# EAGLE design basic board (EAGLE 9.1.3)
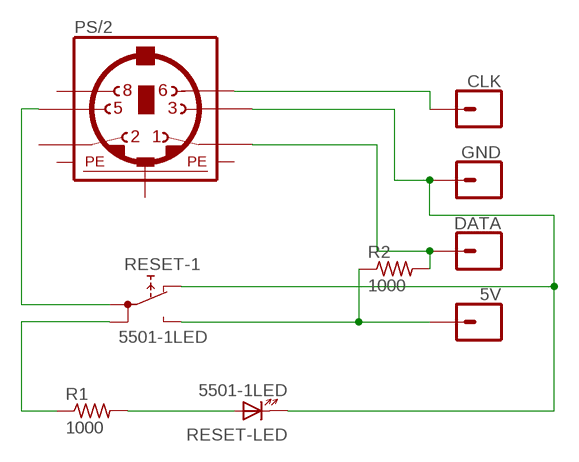
[diagram p0: schematic, sheet 1]

## Parts
5V  CONN_01  [1X01]
CLK  CONN_01  [1X01]
DATA  CONN_01  [1X01]
GND  CONN_01  [1X01]
PS/2  MINI_DIN_6  [M_DIN6]
R1  1000  R-US_0309/12  [0309/12]
R2  1000  R-US_0309/12  [0309/12]
RESET  5501-1LED  [5501-1LED]

## Nets
GND: GND.1 PS/2.3 RESET.-(-LED:K) RESET.NC(-1:NC)
N$1: CLK.1 PS/2.6
N$3: DATA.1 PS/2.1 R2.2
N$4: PS/2.5 RESET.1A(-1:1A)
N$5: 5V.1 R2.1 RESET.NO(-1:NO)
N$6: R1.1 RESET.1B(-1:1B)
N$7: R1.2 RESET.+(-LED:A)
Unconnected: PS/2.2 PS/2.8

## Power pins joined to a net without a drawn wire
PE1: PS/2.SH1(PE1)
PE2: PS/2.SH2(PE2)
PE3: PS/2.SH3(PE3)

## Library data of the parts
5V CLK DATA GND = SparkFun-Connectors:CONN_01: Single connection point. Often used as Generic Header-pin footprint for 0.1 inch spaced/style header connections On any of the 0.1 inch spaced packages, you can populate with these: Break Away Headers - Straight <https://www.sparkfun.com/products/116> (PRT-00116) Break Away Male Headers - Right Angle <https://www.sparkfun.com/products/553> (PRT-00553) Female Headers <https://www.sparkfun.com/products/115> (PRT-00115) Break Away Headers - Machine Pin <https://www.sparkfun.com/products/117> (PRT-00117) Break Away Female Headers - Swiss Machine Pin <https://www.sparkfun.com/products/743> (PRT-00743) This device is also useful as a general connection point to wire up your design to another part of your project. Our various solder wires solder well into these plated through hole pads. Hook-Up Wire - Assortment (Stranded, 22 AWG) <https://www.sparkfun.com/products/11375> (PRT-11375) Hook-Up Wire - Assortment (Solid Core, 22 AWG) <https://www.sparkfun.com/products/11367> (PRT-11367) View the entire wire category on our website here <https://www.sparkfun.com/categories/141> Special notes: SMTSO-256-ET is a "flush mount" nut for a 4-40 screw. We mostly use this on specialty testbeds; it is a nice way to connect hardware to your PCB at an adjustable hieght. Also note, the SNAP packages are for using a snappable style connector. We sell a baggie of snaps and they are also used on two LilyPad designs: Snap Assortment - 30 pack (male and female) <https://www.sparkfun.com/products/11347> (DEV-11347) LilyPad Arduino SimpleSnap <https://www.sparkfun.com/products/10941> (DEV-10941) LilyPad SimpleSnap Protoboard <https://www.sparkfun.com/products/10940> (DEV-10940)
PS/2 = mini_din:MINI_DIN_6
R1 R2 = resistor:R-US_: RESISTOR, American symbol
RESET = switch:55?-1LED: PUSHBUTTON SERIES 5500 SWITCHES 1 LED Source: www.e-switch.com .. 5500.pdf

## Board
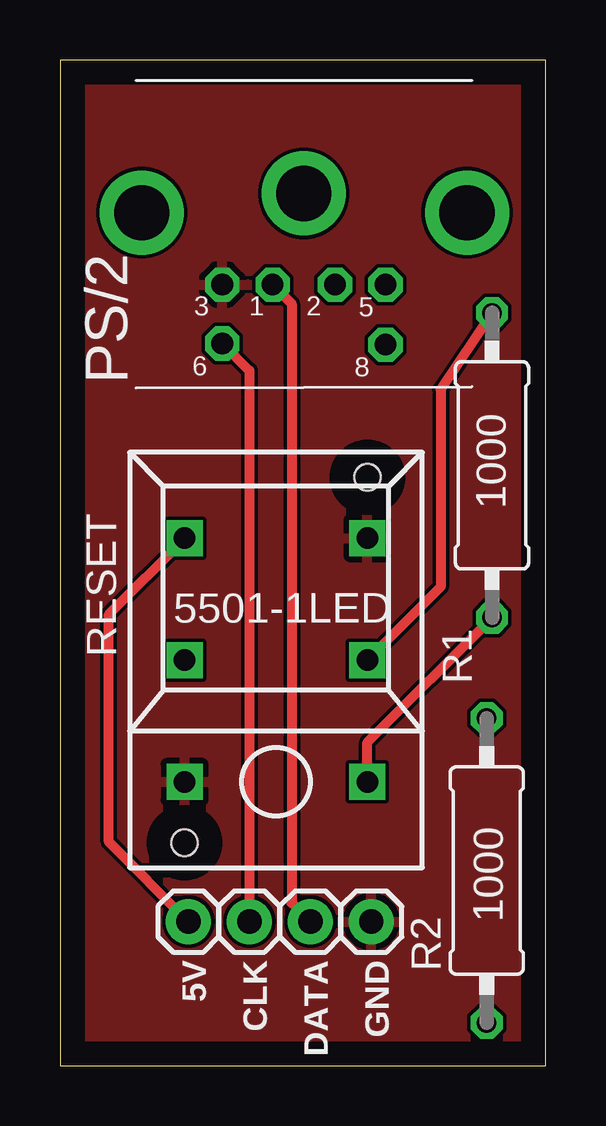
[diagram p1: board, top side]
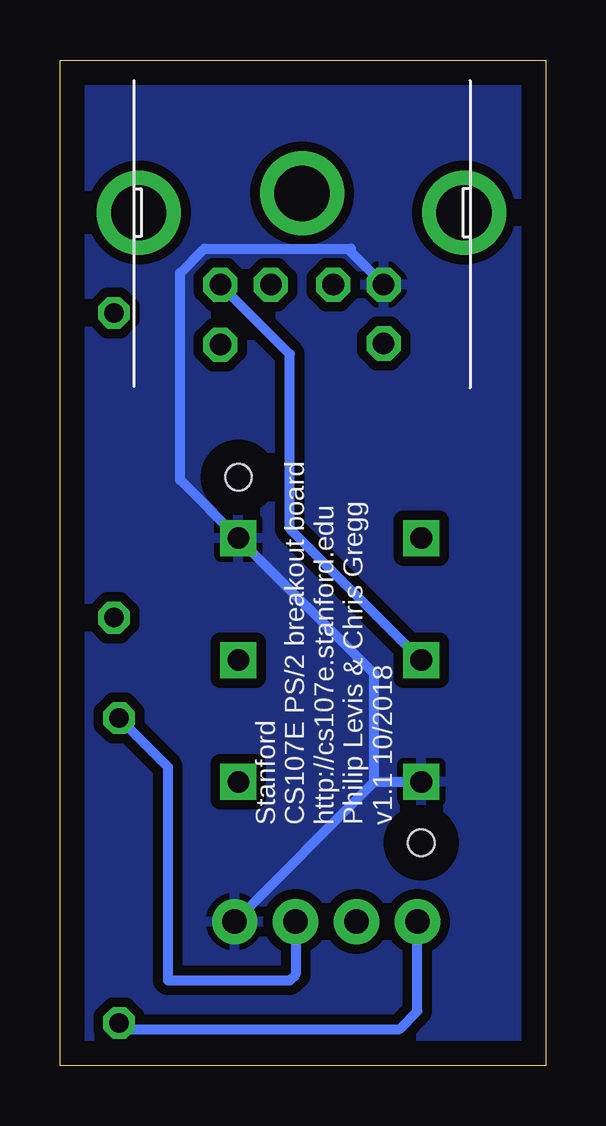
[diagram p2: board, bottom side, seen from below]

Size 20.24 x 41.9 mm. Coordinates in mm from the lower left corner, seen from the top.
Outline: 0,0 20.24,0 20.24,41.9 0,41.9 0,0
Copper layers (1*16): Top 0.035mm / dielectric 1.5mm / Bottom 0.035mm
Design rules "default": minimum track width 6mil, minimum drill 0.35mm, track to track 6mil, track to pad 6mil, pad to pad 6mil, via to via 6mil, smd to smd 6mil, copper to edge 40mil, drill to drill 6mil, minimum pad ring 10mil, minimum via ring 8mil, stop-mask expansion 4mil, vias tented up to drill 0mil, thermal gap 10mil

### Footprints (pad centres in the part's own frame; a part is rotated, then mirrored left to right if it is on the bottom)
1X01 = drill 1.016 pad 1.88: 1 0,0
M_DIN6 = drill 0.9 pad 1.422 octagon: 1 -1.3,-3.75; 2 1.3,-3.75; 3 -3.4,-3.75; 5 3.4,-3.75; 6 -3.4,-6.2; 8 3.4,-6.25 | drill 2.3 pad 3.5: SH1 6.8,-0.75; SH2 0,0.05; SH3 -6.75,-0.75
0309/12 = drill 0.813 octagon: 1 -6.35,0; 2 6.35,0
5501-1LED = drill 0.9 pad 1.5 square: 1A 0,3.81; 1B 0,-3.81; + -5.08,-3.81; - -5.08,3.81; NC 5.08,-3.81; NO 5.08,3.81 | hole 1.1: -7.62,3.81; 7.62,-3.81

### Placement (x,y rotation side)
5V  5.35,6 0 top
CLK  7.89,6 0 top
DATA  10.43,6 0 top
GND  12.97,6 0 top
PS/2  10.16,36.29 0 top
R1  18,25.01 270 top
R2  17.78,8.13 90 top
RESET  9,16.9 90 top

### Tracks (layer width: path | path; a pad name or v marks a point on that pad's centre or on a via)
GND
  Bottom 0.406: GND.1 7.15,11.82 | 7.15,11.82 RESET.- | 7.15,11.82 7.15,16.32 RESET.NC 15.24,24.41 15.24,33.02 14.22,34.04 8.13,34.04 8.13,33.91 PS/2.3
  pour Top: 0,41.66 20.32,41.66 20.32,0 0,0
  pour Bottom (isolate 0.406): 0,41.66 20.32,41.66 20.32,0 0,0
N$1
  Top 0.406: PS/2.6 7.89,28.96 CLK.1
N$3
  Top 0.406: PS/2.1 9.65,31.75 9.65,6.78 DATA.1
  Bottom 0.406: R2.2 15.75,12.45 15.75,3.56 10.67,3.56 10.43,3.79 DATA.1
N$4
  Bottom 0.406: RESET.1A 10.67,22.38 10.67,29.65 PS/2.5
N$5
  Top 0.406: 5V.1 2.03,9.32 2.03,18.8 5.19,21.95 RESET.NO
  Bottom 0.406: R2.1 17.53,1.52 6.1,1.52 5.35,2.27 5V.1
N$6
  Top 0.406: R1.1 15.86,28.17 15.86,19.95 RESET.1B
N$7
  Top 0.406: R1.2 12.81,13.47 RESET.+

### Text on the board
bPlace: Stanford / CS107E PS/2 breakout board / http://cs107e.stanford.edu / Philip Levis & Chris Gregg / v1.1 10/2018